# Altium schematic sheet GSM.SchDoc
size A3
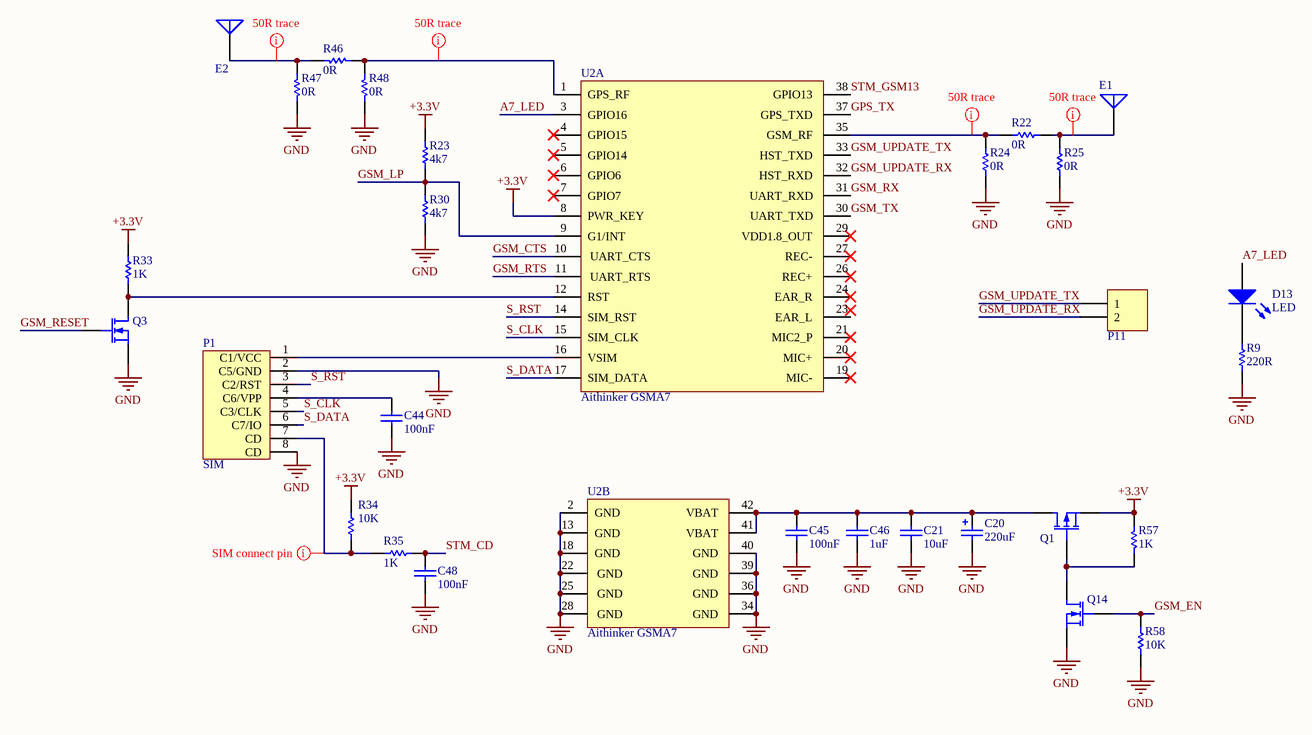
[diagram p0: GSM.SchDoc]

## Parts
C20  value 220uF  [CAP-D]  (hidden comment: Tantalum 220uF)
C21  value 10uF  [C0603]  (hidden comment: Cap 10uF)
C44  value 100nF  [C0402]  (hidden comment: Cap 100nF)
C45  value 100nF  [C0402]  (hidden comment: Cap 100nF)
C46  value 1uF  [C0402]  (hidden comment: Cap 1uF)
C48  value 100nF  [C0402]  (hidden comment: Cap 100nF)
D13  LED  [0603LedRed]
E1  Antenna  [SMA connector]  (value not drawn)
E2  Antenna  [SMA connector]  (value not drawn)
P1  SIM  [SIM TRAY]
P11  Header 2  [HDR1X2]  (value not drawn)
Q1  AO3401A  [SOT23]  (value not drawn)
Q3  AO3400A  [SOT23]  (value not drawn)
Q14  AO3400A  [SOT23]  (value not drawn)
R9  value 220R  [R0402]  (hidden comment: Res_220R)
R22  value 0R  [R0402]  (hidden comment: Res_0R)
R23  value 4k7  [R0402]  (hidden comment: Res_4k7)
R24  value 0R  [R0402]  (hidden comment: Res_0R)
R25  value 0R  [R0402]  (hidden comment: Res_0R)
R30  value 4k7  [R0402]  (hidden comment: Res_4k7)
R33  value 1K  [R0402]  (hidden comment: Res_1K)
R34  value 10K  [R0402]  (hidden comment: Res_10K)
R35  value 1K  [R0402]  (hidden comment: Res_1K)
R46  value 0R  [R0402]  (hidden comment: Res_0R)
R47  value 0R  [R0402]  (hidden comment: Res_0R)
R48  value 0R  [R0402]  (hidden comment: Res_0R)
R57  value 1K  [R0402]  (hidden comment: Res_1K)
R58  value 10K  [R0402]  (hidden comment: Res_10K)
U2  Aithinker GSMA7  [A7]  (parts A,B of 2)

## Nets
+3.3V: Q1.2(S) R23.2 R33.2 R34.2 R57.2 U2.8(PWR_KEY)
GND: C20.1 C21.1 C44.1 C45.1 C46.1 C48.1 P1.2(C5/GND) P1.8(CD) Q3.2(S) Q14.2(S) R9.1 R24.1 R25.1 R30.1 R47.1 R48.1 R58.1 U2.2(GND) U2.13(GND) U2.18(GND) U2.22(GND) U2.25(GND) U2.28(GND) U2.34(GND) U2.36(GND) U2.39(GND) U2.40(GND)
A7_LED: D13.1(A) U2.3(GPIO16)
GPS_TX: U2.37(GPS_TXD)
GSM_CTS: U2.10(UART_CTS)
GSM_EN: Q14.1(G) R58.2
GSM_LP: R23.1 R30.2 U2.9(G1/INT)
GSM_RESET: Q3.1(G)
GSM_RTS: U2.11(UART_RTS)
GSM_RX: U2.31(UART_RXD)
GSM_TX: U2.30(UART_TXD)
GSM_UPDATE_RX: P11.2 U2.32(HST_RXD)
GSM_UPDATE_TX: P11.1 U2.33(HST_TXD)
S_CLK: P1.5(C3/CLK) U2.15(SIM_CLK)
S_DATA: P1.6(C7/IO) U2.17(SIM_DATA)
S_RST: P1.3(C2/RST) U2.14(SIM_RST)
STM_CD: C48.2 R35.2
STM_GSM13: U2.38(GPIO13)
NetC20_2: C20.2 C21.2 C45.2 C46.2 Q1.3(D) U2.41(VBAT) U2.42(VBAT)
NetC44_2: C44.2 P1.4(C6/VPP)
NetD13_2: D13.2(K) R9.2
NetE1_1: E1.1(A) R22.2 R25.2
NetE2_1: E2.1(A) R46.2 R47.2
NetP1_1: P1.1(C1/VCC) U2.16(VSIM)
NetP1_7: P1.7(CD) R34.1 R35.1
NetQ1_1: Q1.1(G) Q14.3(D) R57.1
NetQ3_3: Q3.3(D) R33.1 U2.12(RST)
NetR22_1: R22.1 R24.2 U2.35(GSM_RF)
NetR46_1: R46.1 R48.2 U2.1(GPS_RF)

Not connected (* = marked no-connect by the designer): U2 4(GPIO15)* 5(GPIO14)* 6(GPIO6)* 7(GPIO7)* 19(MIC-)* 20(MIC+)* 21(MIC2_P)* 23(EAR_L) 24(EAR_R)* 26(REC+)* 27(REC-)* 29(VDD1.8_OUT)*

## Layout directives
mark named 50R trace: NetE1_1, NetE2_1, NetR22_1, NetR46_1
mark named SIM connect pin: NetP1_7

## Library data of the parts
C20 = Tantalum 220uF: Polarized Tantalum Capacitor
C21 = Cap 10uF: Capacitor
C44 C45 C48 = Cap 100nF: Capacitor
C46 = Cap 1uF: Capacitor
D13 = LED: Typical RED GaAs LED; Published: 8-Jun-2000; LatestRevisionDate: 08-Jul-2005; LatestRevisionNote: Mech Layer 1 removed.; PackageReference: LED-1; Publisher: Altium Limited; PackageDescription: LED; 2 Leads
E1 E2 = Antenna: Generic Antenna; Published: 24-Mar-1999; LatestRevisionDate: 17-Jul-2002; LatestRevisionNote: Re-released for DXP Platform.; PackageReference: PIN1; Publisher: Altium Limited; ComponentLink1Description: tme; ComponentLink1URL: https://www.tme.eu/pl/details/rf2-19a-t-00-50-g/zlacza-sma-smb-smc/adam-tech/
P1 = SIM: SIM card connector; ComponentLink1Description: tme; ComponentLink1URL: https://www.tme.eu/pl/details/mx-47553-0001/zlacza-do-kart/molex/47553-0001/; ComponentLink2Description: molex; ComponentLink2URL: https://www.molex.com/molex/products/part-detail/memory_card_socket/0475530001
P11 = Header 2: Header, 2-Pin; LatestRevisionDate: 17-Jul-2002; LatestRevisionNote: Re-released for DXP Platform.; Publisher: Altium Limited
Q1 = MOSFET-P: P-Channel MOSFET AO3401A; Published: 8-Jun-2000; LatestRevisionDate: 17-Jul-2002; LatestRevisionNote: Re-released for DXP Platform.; PackageVersion: 1995/1996; PackageReference: E3; Publisher: Altium Limited; PackageDescription: TO, Flat Index; 3 In-Line, Axial Leads; Body Dia. 4.6mm; Lead Dia. 0.5 mm (max); ComponentLink1Description: datasheet; ComponentLink1URL: https://datasheet.lcsc.com/szlcsc/Alpha-Omega-Semicon-AOS-AO3401A_C15127.pdf
Q3 Q14 = MOSFET-N: N-MOSFET AO3400A; Published: 8-Jun-2000; LatestRevisionDate: 17-Jul-2002; LatestRevisionNote: Re-released for DXP Platform.; PackageVersion: 1995/1996; PackageReference: E3; Publisher: Altium Limited; PackageDescription: TO, Flat Index; 3 In-Line, Axial Leads; Body Dia. 4.6mm; Lead Dia. 0.5 mm (max); ComponentLink1Description: datasheet; ComponentLink1URL: https://datasheet.lcsc.com/szlcsc/1908271131_Youtai-Semiconductor-Co-Ltd-AO3400A_C347475.pdf
R9 = Res_220R: Resistor
R22 R24 R25 R46-R48 = Res_0R: Resistor
R23 R30 = Res_4k7: Resistor
R33 R35 R57 = Res_1K: Resistor
R34 R58 = Res_10K: Resistor
U2 = GSM_A7: Aitkinker GSM A7 module; Manufacturer: STMicroelectronics; PartNumber: STM32L152CCU6; Core: ARM Cortex-M3; D/A Converter: 2x12-bit (2 Channel); Data E2PROM nom (B): 8192; Display controller: LCD 4x18; FLASH Size (Prog) (kB): 256; I/Os (High Current): 37; Internal RAM Size (kB): 32; Packing: Tray; Supply Voltage(Vcc) min (V): 1.65; DatasheetVersion: Rev. 3; PackageVersion: Rev. 1, 04/2013; PackageReference: UFQFPN48; PackageDescription: 48-Pin Ultra Thin Fine Pitch Quad Flat No-Lead, 7 x 7 x 0.6 mm Body, 0.5 mm Pitch, Exposed Pad; Operating Frequency(F) (Processor speed) (MHz): 32; Mounting Technology: Surface Mount